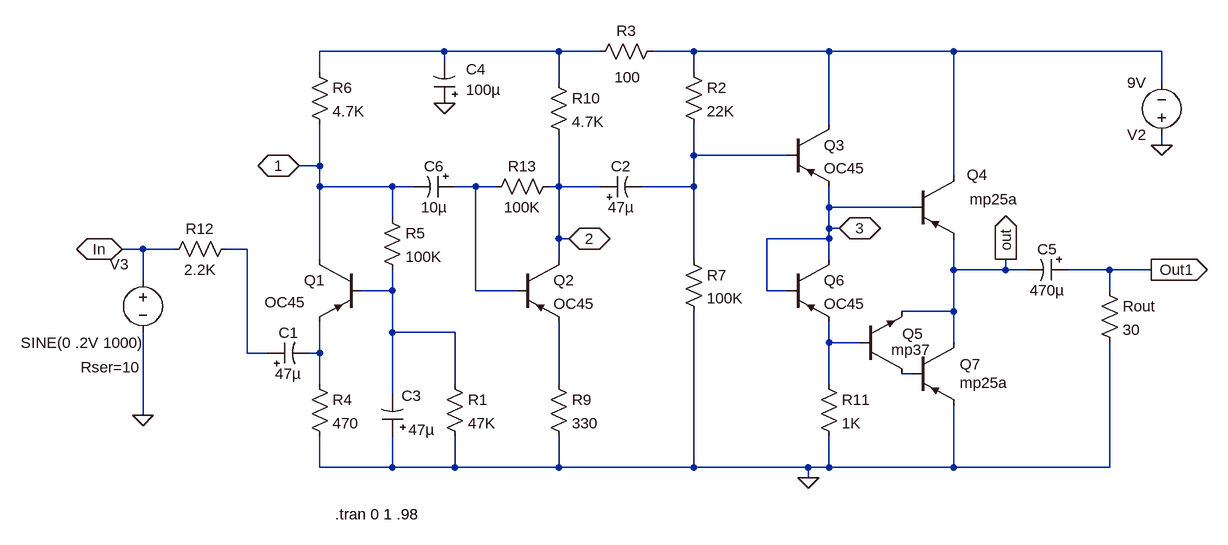
[diagram p0: schematic headamp2.1.asc]
headamp2.1.asc, the LTspice schematic file:
Version 4
SHEET 1 1268 680
WIRE -448 -912 -640 -912
WIRE -272 -912 -448 -912
WIRE -208 -912 -272 -912
WIRE -64 -912 -128 -912
WIRE 144 -912 -64 -912
WIRE 336 -912 144 -912
WIRE 656 -912 336 -912
WIRE -448 -896 -448 -912
WIRE -640 -880 -640 -912
WIRE -64 -880 -64 -912
WIRE -272 -864 -272 -912
WIRE 656 -864 656 -912
WIRE 144 -800 144 -912
WIRE 656 -768 656 -784
WIRE -64 -752 -64 -800
WIRE 80 -752 -64 -752
WIRE -640 -736 -640 -800
WIRE -640 -736 -672 -736
WIRE 336 -720 336 -912
WIRE -640 -704 -640 -736
WIRE -528 -704 -640 -704
WIRE -496 -704 -528 -704
WIRE -400 -704 -432 -704
WIRE -368 -704 -400 -704
WIRE -272 -704 -272 -784
WIRE -272 -704 -288 -704
WIRE -208 -704 -272 -704
WIRE -64 -704 -64 -752
WIRE -64 -704 -144 -704
WIRE 144 -672 144 -704
WIRE 272 -672 144 -672
WIRE -528 -656 -528 -704
WIRE 144 -640 144 -672
WIRE 160 -640 144 -640
WIRE -272 -624 -272 -704
WIRE -256 -624 -272 -624
WIRE 144 -624 144 -640
WIRE 144 -624 48 -624
WIRE -912 -608 -944 -608
WIRE -864 -608 -912 -608
WIRE -752 -608 -784 -608
WIRE -640 -592 -640 -704
WIRE -272 -592 -272 -624
WIRE -64 -592 -64 -704
WIRE 144 -592 144 -624
WIRE 336 -576 336 -624
WIRE 416 -576 416 -592
WIRE 416 -576 336 -576
WIRE 448 -576 416 -576
WIRE 576 -576 512 -576
WIRE 640 -576 576 -576
WIRE -912 -560 -912 -608
WIRE -528 -544 -528 -576
WIRE -528 -544 -576 -544
WIRE -400 -544 -400 -704
WIRE -336 -544 -400 -544
WIRE 48 -544 48 -624
WIRE 80 -544 48 -544
WIRE 576 -544 576 -576
WIRE 336 -512 336 -576
WIRE 336 -512 256 -512
WIRE -528 -480 -528 -544
WIRE -432 -480 -528 -480
WIRE 144 -464 144 -496
WIRE 192 -464 144 -464
WIRE 336 -464 336 -512
WIRE -752 -448 -752 -608
WIRE -720 -448 -752 -448
WIRE -640 -448 -640 -496
WIRE -640 -448 -656 -448
WIRE 272 -416 256 -416
WIRE -640 -400 -640 -448
WIRE -432 -400 -432 -480
WIRE -272 -400 -272 -496
WIRE 144 -400 144 -464
WIRE -528 -384 -528 -480
WIRE -912 -352 -912 -480
WIRE -640 -272 -640 -320
WIRE -528 -272 -528 -320
WIRE -528 -272 -640 -272
WIRE -432 -272 -432 -320
WIRE -432 -272 -528 -272
WIRE -272 -272 -272 -320
WIRE -272 -272 -432 -272
WIRE -64 -272 -64 -512
WIRE -64 -272 -272 -272
WIRE 112 -272 -64 -272
WIRE 144 -272 144 -320
WIRE 144 -272 112 -272
WIRE 336 -272 336 -368
WIRE 336 -272 144 -272
WIRE 576 -272 576 -464
WIRE 576 -272 336 -272
WIRE 112 -256 112 -272
FLAG 656 -768 0
FLAG 112 -256 0
FLAG 640 -576 Out1
IOPIN 640 -576 Out
FLAG -912 -352 0
FLAG 416 -592 out
IOPIN 416 -592 Out
FLAG -448 -832 0
FLAG -672 -736 1
IOPIN -672 -736 BiDir
FLAG -256 -624 2
IOPIN -256 -624 BiDir
FLAG 160 -640 3
IOPIN 160 -640 BiDir
FLAG -944 -608 In
IOPIN -944 -608 BiDir
SYMBOL voltage 656 -768 R180
WINDOW 123 0 0 Left 2
WINDOW 39 24 -12 Left 2
SYMATTR InstName V2
SYMATTR Value 9V
SYMBOL pnp 272 -720 R0
WINDOW 0 84 -2 Left 2
WINDOW 3 89 35 Left 2
SYMATTR InstName Q4
SYMATTR Value mp25a
SYMBOL polcap 512 -592 R90
WINDOW 0 0 32 VBottom 2
WINDOW 3 32 32 VTop 2
SYMATTR InstName C5
SYMATTR Value 470µ
SYMATTR Description Capacitor
SYMATTR Type cap
SYMATTR SpiceLine V=25 Irms=470m Rser=0.16 Lser=0 mfg="Nichicon" pn="UPR1E471MPH" type="Al electrolytic"
SYMBOL res 128 -416 R0
SYMATTR InstName R11
SYMATTR Value 1K
SYMBOL voltage -912 -576 R0
WINDOW 39 -96 150 Left 2
WINDOW 3 -188 112 Left 2
WINDOW 0 -51 -9 Left 2
SYMATTR SpiceLine Rser=10
SYMATTR Value SINE(0 .2V 1000)
SYMATTR InstName V3
SYMATTR Value2 AC 1
SYMBOL res 560 -560 R0
SYMATTR InstName Rout
SYMATTR Value 30
SYMBOL pnp 80 -800 R0
SYMATTR InstName Q3
SYMATTR Value OC45
SYMBOL res -80 -896 R0
SYMATTR InstName R2
SYMATTR Value 22K
SYMBOL res -112 -928 R90
WINDOW 0 0 56 VBottom 2
WINDOW 3 40 54 VTop 2
SYMATTR InstName R3
SYMATTR Value 100
SYMBOL pnp -576 -592 M0
WINDOW 3 86 66 Left 2
SYMATTR Value OC45
SYMATTR InstName Q1
SYMBOL res -544 -672 R0
SYMATTR InstName R5
SYMATTR Value 100K
SYMBOL res -656 -896 R0
SYMATTR InstName R6
SYMATTR Value 4.7K
SYMBOL res -656 -416 R0
SYMATTR InstName R4
SYMATTR Value 470
SYMBOL res -80 -608 R0
SYMATTR InstName R7
SYMATTR Value 100K
SYMBOL polcap -512 -320 R180
WINDOW 0 -29 62 Left 2
WINDOW 3 -49 10 Left 2
SYMATTR InstName C3
SYMATTR Value 47µ
SYMATTR Description Capacitor
SYMATTR Type cap
SYMATTR SpiceLine V=16 Irms=85m Rser=1.8 Lser=0 mfg="Nichicon" pn="UPR1C470MAH" type="Al electrolytic"
SYMBOL pnp -336 -592 R0
SYMATTR InstName Q2
SYMATTR Value OC45
SYMBOL res -288 -416 R0
SYMATTR InstName R9
SYMATTR Value 330
SYMBOL res -288 -880 R0
SYMATTR InstName R10
SYMATTR Value 4.7K
SYMBOL res -272 -720 R90
WINDOW 0 0 56 VBottom 2
WINDOW 3 32 56 VTop 2
SYMATTR InstName R13
SYMATTR Value 100K
SYMBOL npn 192 -416 M180
WINDOW 0 65 62 Left 2
WINDOW 3 48 37 Left 2
SYMATTR InstName Q5
SYMATTR Value mp37
SYMBOL pnp 272 -464 R0
WINDOW 0 73 33 Left 2
WINDOW 3 73 62 Left 2
SYMATTR InstName Q7
SYMATTR Value mp25a
SYMBOL res -768 -624 R90
WINDOW 0 0 56 VBottom 2
WINDOW 3 32 56 VTop 2
SYMATTR InstName R12
SYMATTR Value 2.2K
SYMBOL polcap -432 -832 R180
WINDOW 0 -48 53 Left 2
WINDOW 3 -71 21 Left 2
SYMATTR InstName C4
SYMATTR Value 100µ
SYMATTR Description Capacitor
SYMATTR Type cap
SYMATTR SpiceLine V=16 Irms=85m Rser=1.8 Lser=0
SYMBOL polcap -720 -432 R270
WINDOW 0 32 32 VTop 2
WINDOW 3 0 32 VBottom 2
SYMATTR InstName C1
SYMATTR Value 47µ
SYMATTR Description Capacitor
SYMATTR Type cap
SYMATTR SpiceLine V=16 Irms=85m Rser=1.8 Lser=0 mfg="Nichicon" pn="UPR1C470MAH" type="Al electrolytic"
SYMBOL polcap -432 -720 R90
WINDOW 0 0 32 VBottom 2
WINDOW 3 32 32 VTop 2
SYMATTR InstName C6
SYMATTR Value 10µ
SYMATTR Description Capacitor
SYMATTR Type cap
SYMATTR SpiceLine V=16 Irms=85m Rser=1.8 Lser=0
SYMBOL polcap -208 -688 R270
WINDOW 0 32 32 VTop 2
WINDOW 3 0 32 VBottom 2
SYMATTR InstName C2
SYMATTR Value 47µ
SYMATTR Description Capacitor
SYMATTR Type cap
SYMATTR SpiceLine V=16 Irms=85m Rser=1.8 Lser=0
SYMBOL pnp 80 -592 R0
SYMATTR InstName Q6
SYMATTR Value OC45
SYMBOL res -448 -416 R0
SYMATTR InstName R1
SYMATTR Value 47K
TEXT -616 -200 Left 2 !.tran 0 1 .98

The netlist it stands for:
* headamp2.1.asc
V2 0 N002 9V
Q4 N002 3 out 0 mp25a
C5 Out1 out 470µ V=25 Irms=470m Rser=0.16 Lser=0 mfg="Nichicon" pn="UPR1E471MPH" type="Al electrolytic"
R11 N007 0 1K
V3 In 0 SINE(0 .2V 1000) AC 1 Rser=10
Rout Out1 0 30
Q3 N002 N003 3 0 OC45
R2 N002 N003 22K
R3 N002 N001 100
Q1 1 N006 N008 0 OC45
R5 1 N006 100K
R6 N001 1 4.7K
R4 N008 0 470
R7 N003 0 100K
C3 0 N006 47µ V=16 Irms=85m Rser=1.8 Lser=0 mfg="Nichicon" pn="UPR1C470MAH" type="Al electrolytic"
Q2 2 N004 N010 0 OC45
R9 N010 0 330
R10 N001 2 4.7K
R13 2 N004 100K
Q5 N009 N007 out 0 mp37
Q7 out N009 0 0 mp25a
R12 N005 In 2.2K
C4 0 N001 100µ V=16 Irms=85m Rser=1.8 Lser=0
C1 N005 N008 47µ V=16 Irms=85m Rser=1.8 Lser=0 mfg="Nichicon" pn="UPR1C470MAH" type="Al electrolytic"
C6 N004 1 10µ V=16 Irms=85m Rser=1.8 Lser=0
C2 2 N003 47µ V=16 Irms=85m Rser=1.8 Lser=0
Q6 3 3 N007 0 OC45
R1 N006 0 47K
.model NPN NPN
.model PNP PNP
.lib standard.bjt
.tran 0 1 .98
.backanno
.end